# Altium schematic sheet power.SchDoc
size A4; SheetNumber: 3; SheetTotal: 5
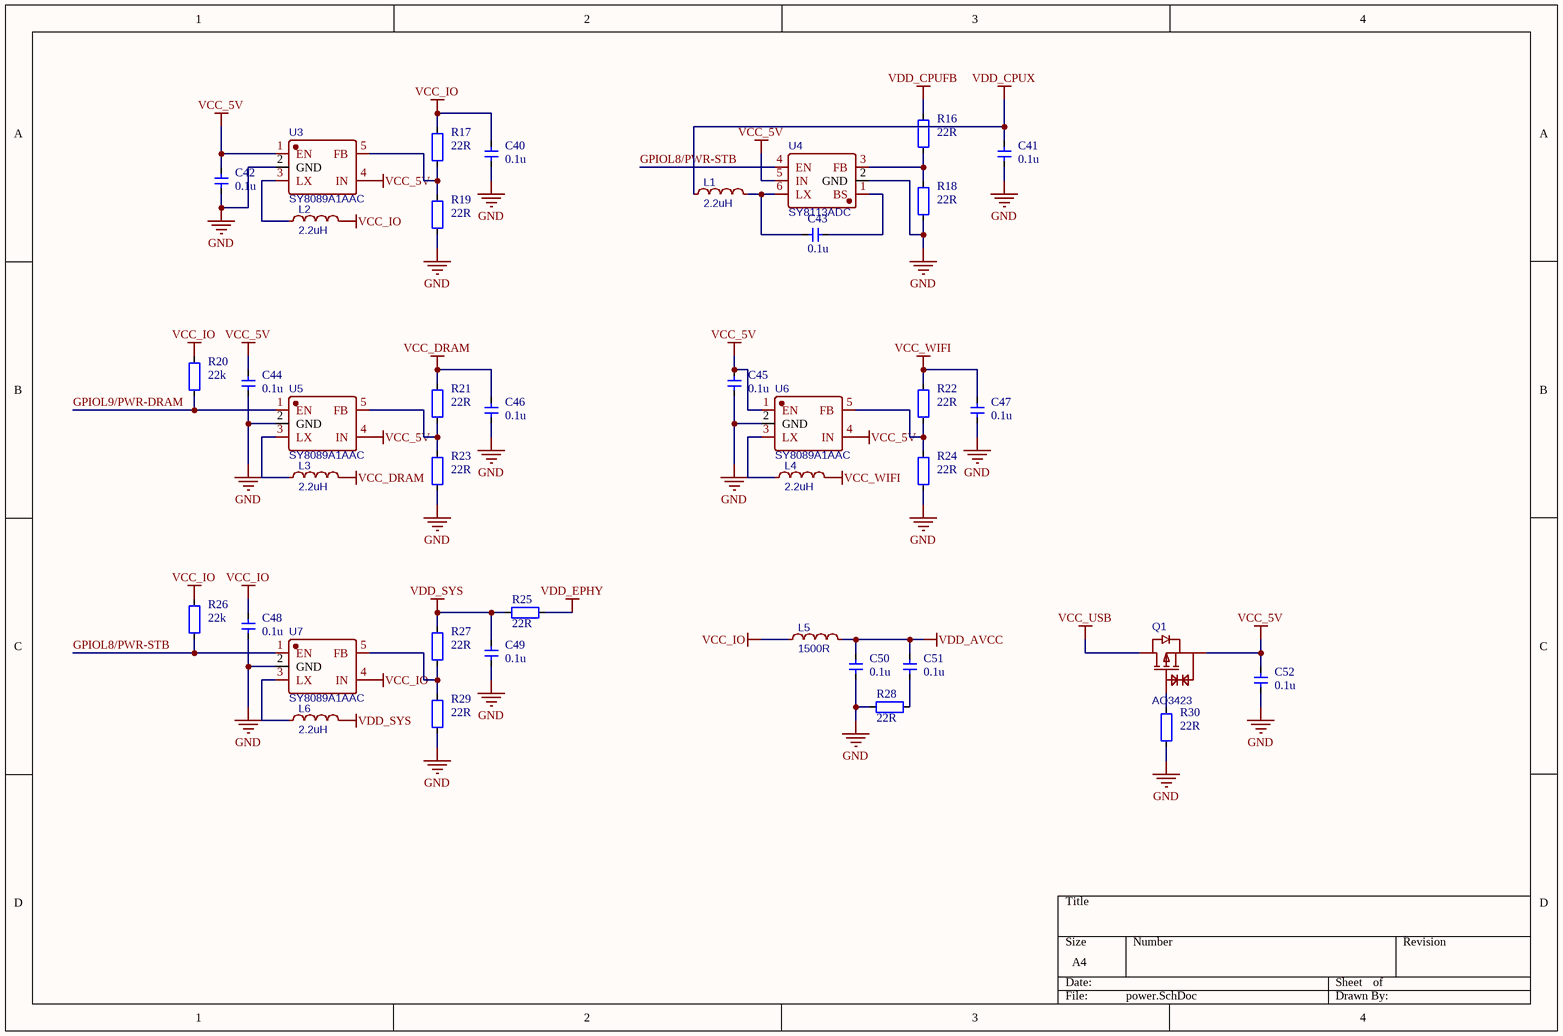
[diagram p0: power.SchDoc]

## Parts
C40  value 0.1u  [C0402]  (hidden comment: CAP-0402)
C41  value 0.1u  [C0402]  (hidden comment: CAP-0402)
C42  value 0.1u  [C0402]  (hidden comment: CAP-0402)
C43  value 0.1u  [C0402]  (hidden comment: CAP-0402)
C44  value 0.1u  [C0402]  (hidden comment: CAP-0402)
C45  value 0.1u  [C0402]  (hidden comment: CAP-0402)
C46  value 0.1u  [C0402]  (hidden comment: CAP-0402)
C47  value 0.1u  [C0402]  (hidden comment: CAP-0402)
C48  value 0.1u  [C0402]  (hidden comment: CAP-0402)
C49  value 0.1u  [C0402]  (hidden comment: CAP-0402)
C50  value 0.1u  [C0402]  (hidden comment: CAP-0402)
C51  value 0.1u  [C0402]  (hidden comment: CAP-0402)
C52  value 0.1u  [C0402]  (hidden comment: CAP-0402)
L1  2.2uH  [IND-SMD_L4.4-W4.2]
L2  2.2uH  [IND-SMD_L4.4-W4.2]
L3  2.2uH  [IND-SMD_L4.4-W4.2]
L4  2.2uH  [IND-SMD_L4.4-W4.2]
L5  1500R  [L0402]
L6  2.2uH  [IND-SMD_L4.4-W4.2]
Q1  AO3423  [SOT-23-3_L2.9-W1.6-P1.90-LS2.8-BR]
R16  value 22R  [R0402]  (hidden comment: RES-0402)
R17  value 22R  [R0402]  (hidden comment: RES-0402)
R18  value 22R  [R0402]  (hidden comment: RES-0402)
R19  value 22R  [R0402]  (hidden comment: RES-0402)
R20  value 22k  [R0402]  (hidden comment: RES-0402)
R21  value 22R  [R0402]  (hidden comment: RES-0402)
R22  value 22R  [R0402]  (hidden comment: RES-0402)
R23  value 22R  [R0402]  (hidden comment: RES-0402)
R24  value 22R  [R0402]  (hidden comment: RES-0402)
R25  value 22R  [R0402]  (hidden comment: RES-0402)
R26  value 22k  [R0402]  (hidden comment: RES-0402)
R27  value 22R  [R0402]  (hidden comment: RES-0402)
R28  value 22R  [R0402]  (hidden comment: RES-0402)
R29  value 22R  [R0402]  (hidden comment: RES-0402)
R30  value 22R  [R0402]  (hidden comment: RES-0402)
U3  SY8089A1AAC  [SOT-23-5_L3.0-W1.7-P0.95-LS2.8-BL]
U4  SY8113ADC  [TSOT-23-6_L2.9-W1.6-P0.95-LS2.8-BR]
U5  SY8089A1AAC  [SOT-23-5_L3.0-W1.7-P0.95-LS2.8-BL]
U6  SY8089A1AAC  [SOT-23-5_L3.0-W1.7-P0.95-LS2.8-BL]
U7  SY8089A1AAC  [SOT-23-5_L3.0-W1.7-P0.95-LS2.8-BL]

## Nets
GND: C40.1 C41.1 C42.1 C44.1 C45.1 C46.1 C47.1 C48.1 C49.1 C50.1 C52.1 R18.1 R19.1 R23.1 R24.1 R28.2 R29.1 R30.1 U3.2(GND) U4.2(GND) U5.2(GND) U6.2(GND) U7.2(GND)
VCC_5V: C42.2 C44.2 C45.2 C52.2 Q1.2(S) U3.1(EN) U3.4(IN) U4.5(IN) U5.4(IN) U6.1(EN) U6.4(IN)
VCC_DRAM: C46.2 L3.2 R21.2
VCC_IO: C40.2 C48.2 L2.2 L5.1 R17.2 R20.2 R26.2 U7.4(IN)
VCC_USB: Q1.3(D)
VCC_WIFI: C47.2 L4.2 R22.2
VDD_AVCC: C50.2 C51.2 L5.2
VDD_CPUFB: R16.2
VDD_CPUX: C41.2 L1.1
VDD_EPHY: R25.1
VDD_SYS: C49.2 L6.2 R25.2 R27.2
GPIOL8/PWR-STB: R26.1 U4.4(EN) U7.1(EN)
GPIOL9/PWR-DRAM: R20.1 U5.1(EN)
NetC43_1: C43.1 U4.1(BS)
NetC43_2: C43.2 L1.2 U4.6(LX)
NetC51_1: C51.1 R28.1
NetL2_1: L2.1 U3.3(LX)
NetL3_1: L3.1 U5.3(LX)
NetL4_1: L4.1 U6.3(LX)
NetL6_1: L6.1 U7.3(LX)
NetQ1_1: Q1.1(G) R30.2
NetR16_1: R16.1 R18.2 U4.3(FB)
NetR17_1: R17.1 R19.2 U3.5(FB)
NetR21_1: R21.1 R23.2 U5.5(FB)
NetR22_1: R22.1 R24.2 U6.5(FB)
NetR27_1: R27.1 R29.2 U7.5(FB)

## Library data of the parts
C40-C52 = CAP-0402: Capacitor
L1-L4 L6 = IND_0420: BOM_Manufacturer: TDG; BOM_Manufacturer Part: TMAX-0420-2R2-M; nameAlias: Inductance; Contributor: LCSC; BOM_Supplier: LCSC; BOM_Supplier Part: C429763; spicePre: L; spiceSymbolName: TMAX-0420-2R2-M
L5 = IND_0402: nameAlias: Value(H); Contributor: LCEDA_Lib; spicePre: L; spiceSymbolName: L0402_US
Q1 = AO3423: BOM_Manufacturer: AOS; BOM_Supplier: LCSC; BOM_Manufacturer Part: AO3423; BOM_Supplier Part: C73257; BOM_JLCPCB Part Class: Extended Part; spicePre: Q; spiceSymbolName: AO3423
R16-R30 = RES-0402: Resistor
U3 U5-U7 = SY8089A1AAC: BOM_Manufacturer: Silergy Corp; Contributor: LCSC; BOM_Supplier: LCSC; BOM_Supplier Part: C479074; BOM_Manufacturer Part: SY8089A1AAC; BOM_JLCPCB Part Class: Extended Part; spicePre: U; spiceSymbolName: SY8089A1AAC
U4 = SY8113ADC: BOM_Manufacturer: Silergy Corp; Contributor: LCSC; BOM_Supplier: LCSC; BOM_Supplier Part: C403810; BOM_Manufacturer Part: SY8113ADC; BOM_JLCPCB Part Class: Extended Part; spicePre: U; spiceSymbolName: SY8113ADC